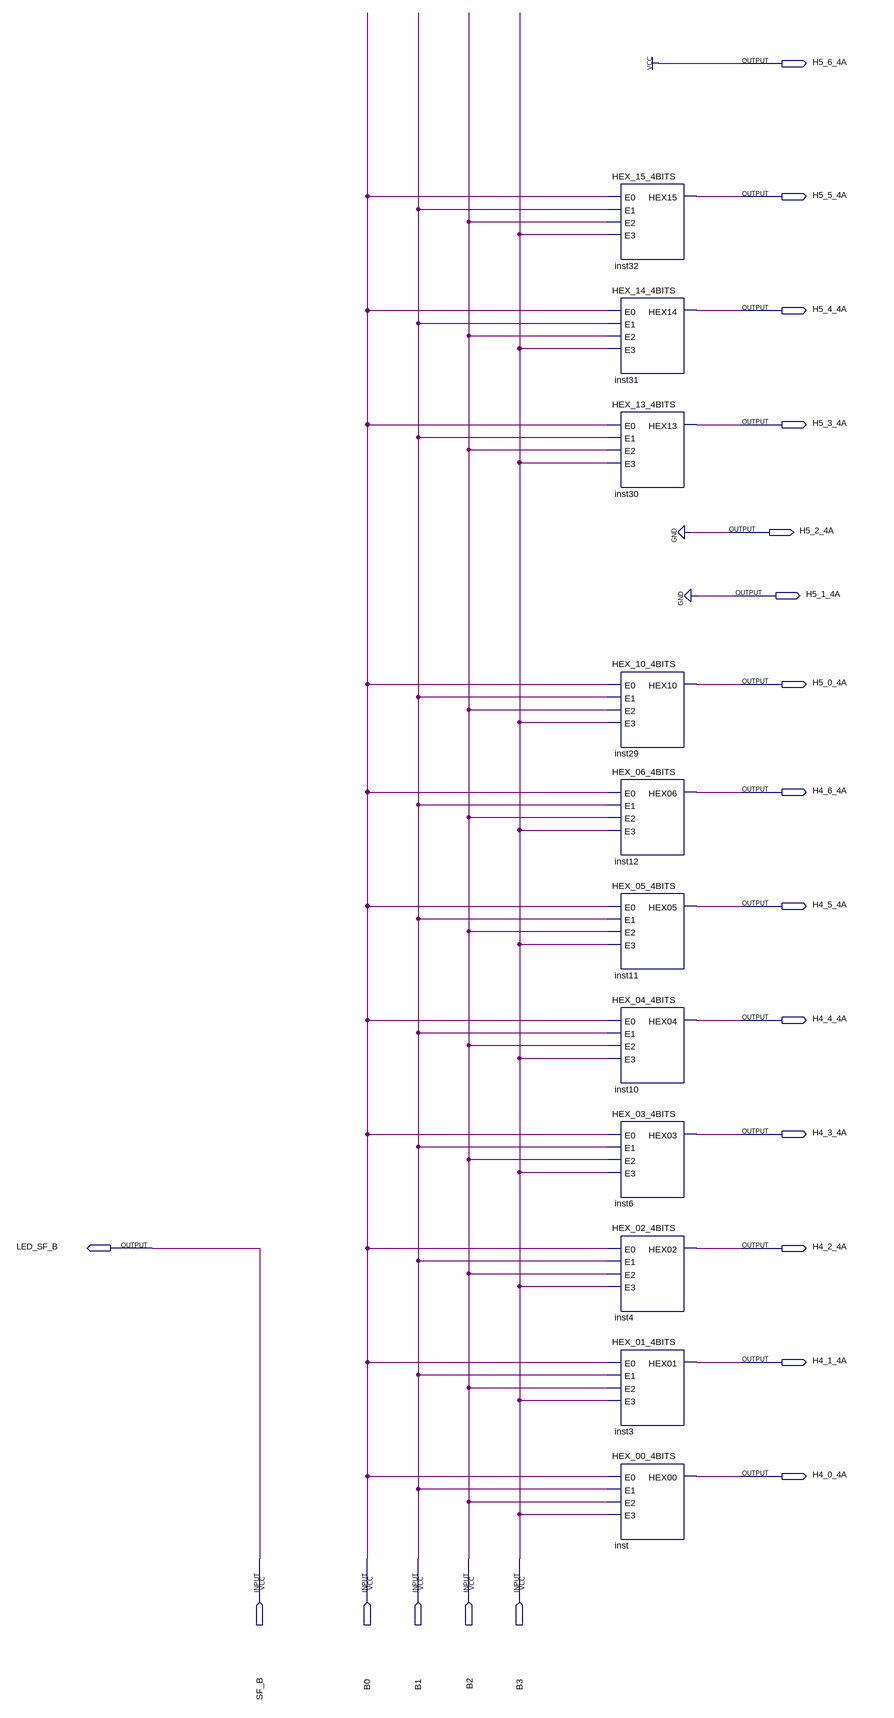
[diagram p0: schematic sheet]
// Quartus schematic decodificador_7_segmentos_B.bdf as structural Verilog: 11 symbols, 20 pins
module decodificador_7_segmentos_B (
  input  SF_B,
  input  B0,
  input  B1,
  input  B2,
  input  B3,
  output H5_6_4A,
  output H5_5_4A,
  output H5_4_4A,
  output H5_3_4A,
  output H5_2_4A,
  output H5_1_4A,
  output H5_0_4A,
  output H4_6_4A,
  output H4_5_4A,
  output H4_4_4A,
  output H4_3_4A,
  output LED_SF_B,
  output H4_2_4A,
  output H4_1_4A,
  output H4_0_4A
);

  HEX_15_4BITS inst32 (.E0(B0), .E1(B1), .E2(B2), .E3(B3), .HEX15(H5_5_4A));
  HEX_14_4BITS inst31 (.E0(B0), .E1(B1), .E2(B2), .E3(B3), .HEX14(H5_4_4A));
  HEX_13_4BITS inst30 (.E0(B0), .E1(B1), .E2(B2), .E3(B3), .HEX13(H5_3_4A));
  HEX_10_4BITS inst29 (.E0(B0), .E1(B1), .E2(B2), .E3(B3), .HEX10(H5_0_4A));
  HEX_06_4BITS inst12 (.E0(B0), .E1(B1), .E2(B2), .E3(B3), .HEX06(H4_6_4A));
  HEX_05_4BITS inst11 (.E0(B0), .E1(B1), .E2(B2), .E3(B3), .HEX05(H4_5_4A));
  HEX_04_4BITS inst10 (.E0(B0), .E1(B1), .E2(B2), .E3(B3), .HEX04(H4_4_4A));
  HEX_03_4BITS inst6 (.E0(B0), .E1(B1), .E2(B2), .E3(B3), .HEX03(H4_3_4A));
  HEX_02_4BITS inst4 (.E0(B0), .E1(B1), .E2(B2), .E3(B3), .HEX02(H4_2_4A));
  HEX_01_4BITS inst3 (.E0(B0), .E1(B1), .E2(B2), .E3(B3), .HEX01(H4_1_4A));
  HEX_00_4BITS inst (.E0(B0), .E1(B1), .E2(B2), .E3(B3), .HEX00(H4_0_4A));

  assign H5_1_4A = 1'b0;
  assign H5_2_4A = 1'b0;
  assign H5_6_4A = 1'b1;
  assign LED_SF_B = SF_B;
endmodule
